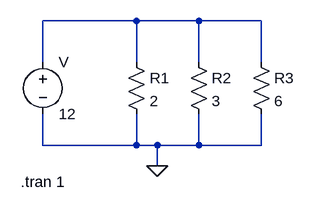
[diagram p0: schematic Ohms_law_parallel_circuit.asc]
Ohms_law_parallel_circuit.asc, the LTspice schematic file:
Version 4
SHEET 1 880 680
WIRE 240 80 96 80
WIRE 336 80 240 80
WIRE 432 80 336 80
WIRE 96 144 96 80
WIRE 240 144 240 80
WIRE 336 144 336 80
WIRE 432 144 432 80
WIRE 96 272 96 224
WIRE 240 272 240 224
WIRE 240 272 96 272
WIRE 272 272 240 272
WIRE 336 272 336 224
WIRE 336 272 272 272
WIRE 432 272 432 224
WIRE 432 272 336 272
WIRE 272 304 272 272
FLAG 272 304 0
SYMBOL voltage 96 128 R0
WINDOW 123 0 0 Left 0
WINDOW 39 0 0 Left 0
SYMATTR InstName V
SYMATTR Value 12
SYMBOL res 224 128 R0
SYMATTR InstName R1
SYMATTR Value 2
SYMBOL res 320 128 R0
SYMATTR InstName R2
SYMATTR Value 3
SYMBOL res 416 128 R0
SYMATTR InstName R3
SYMATTR Value 6
TEXT 62 328 Left 2 !.tran 1

The netlist it stands for:
* Ohms_law_parallel_circuit.asc
V N001 0 12
R1 N001 0 2
R2 N001 0 3
R3 N001 0 6
.tran 1
.backanno
.end